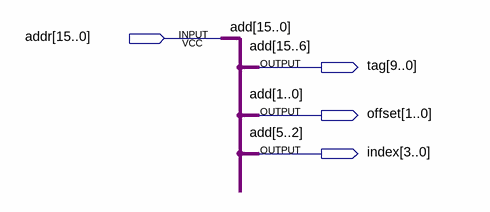
[diagram p0: schematic sheet]
// Quartus schematic addr_parser.bdf as structural Verilog: 0 symbols, 4 pins
module addr_parser (
  input  [15:0] addr,
  output [9:0] tag,
  output [1:0] offset,
  output [3:0] index
);


  assign index = addr[5:2];
  assign offset = addr[1:0];
  assign tag = addr[15:6];

  // Other names for the same wires on the sheet: add[15:0] = addr
endmodule
